# EAGLE schematic Oct20 (EAGLE 7.6.0)
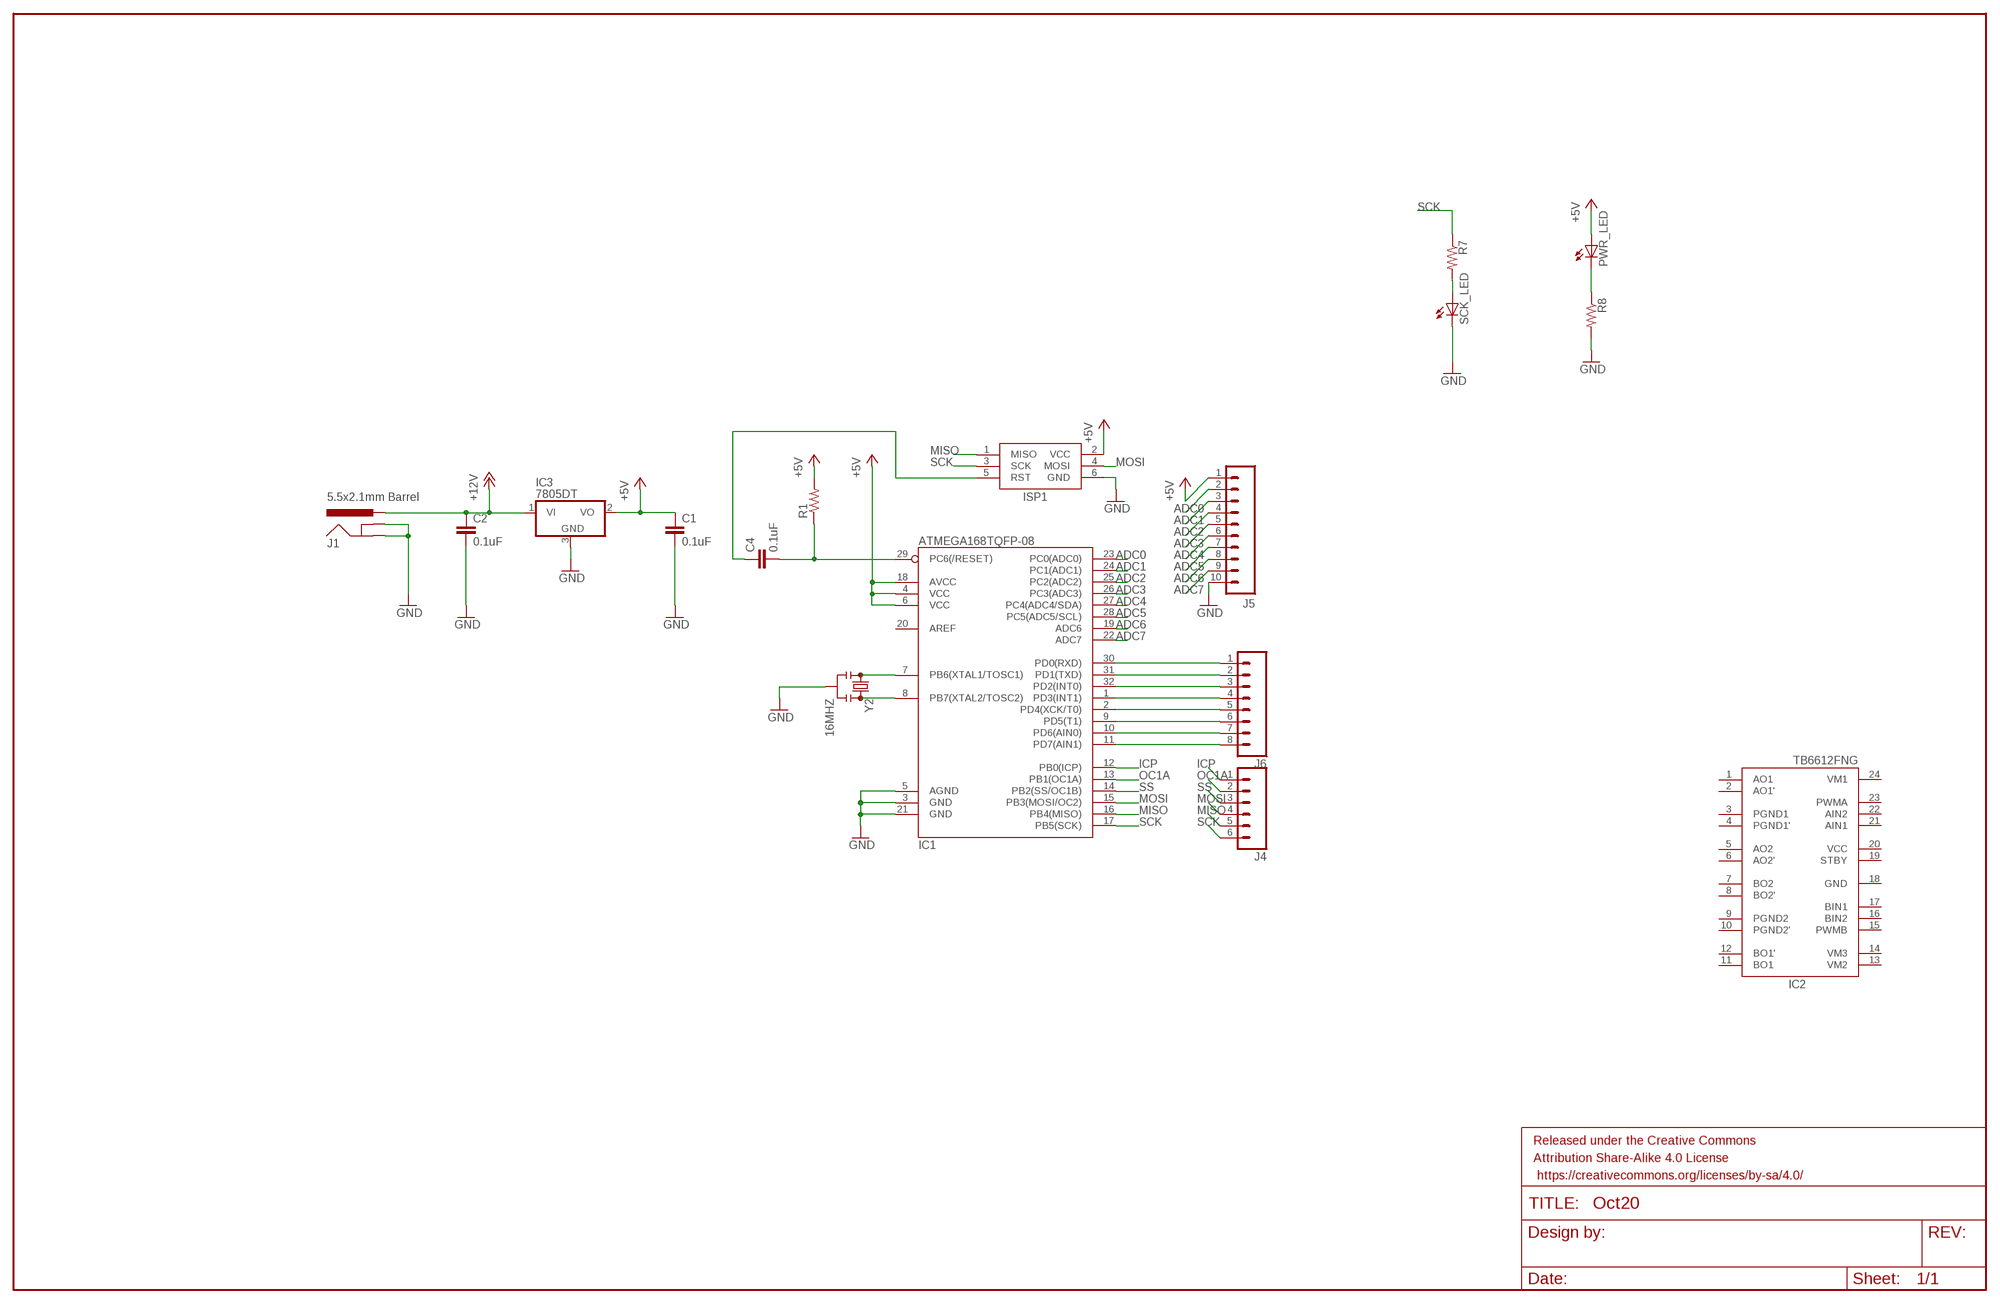
[diagram p0: schematic, sheet 1]

## Parts
C1  0.1uF  0.1UF-25V(+80/-20%)(0603)  [0603-CAP]
C2  0.1uF  0.1UF-25V(+80/-20%)(0603)  [0603-CAP]
C4  0.1uF  0.1UF-25V(+80/-20%)(0603)  [0603-CAP]
FRAME1  FRAME-LEDGER  [CREATIVE_COMMONS]
IC1  ATMEGA168TQFP-08  [TQFP32-08]
IC2  TB6612FNG  [SSOP24]
IC3  7805DT  [TO252]
ISP1  AVRISP-6  [AVRISP]
J1  5.5x2.1mm Barrel  POWER_JACKSMD  [POWER_JACK_SMD]
J4  M06SILK_FEMALE_PTH  [1X06]
J5  M10SILK_FEMALE_PTH  [1X10]
J6  M08  [1X08_ROUND]
PWR_LED  LED_E  [LED_1206]
R1  RESISTORPTH-1/4W  [AXIAL-0.4]
R7  RESISTORPTH-1/4W  [AXIAL-0.4]
R8  RESISTORPTH-1/4W  [AXIAL-0.4]
SCK_LED  LED_E  [LED_1206]
Y2  16MHZ  RESONATOR16MHZ  [RESONATOR-SMD]

## Nets
+5V: C1.1 IC1.4(VCC) IC1.6(VCC) IC1.18(AVCC) IC3.2(VO) ISP1.2(VCC) J5.1 PWR_LED.A R1.P$2
+12V: C2.1 IC3.1(VI) J1.VIN0(PWR)
ADC0: IC1.23(PC0(ADC0)) J5.2
ADC1: IC1.24(PC1(ADC1)) J5.3
ADC2: IC1.25(PC2(ADC2)) J5.4
ADC3: IC1.26(PC3(ADC3)) J5.5
ADC4: IC1.27(PC4(ADC4/SDA)) J5.6
ADC5: IC1.28(PC5(ADC5/SCL)) J5.7
ADC6: IC1.19(ADC6) J5.8
ADC7: IC1.22(ADC7) J5.9
GND: C1.2 C2.2 IC1.3(GND) IC1.5(AGND) IC1.21(GND) IC3.3(GND) ISP1.6(GND) J1.GND(GNDBREAK) J1.P$4(GND) J5.10 R8.P$2 SCK_LED.C Y2.2
ICP: IC1.12(PB0(ICP)) J4.1
MISO: IC1.16(PB4(MISO)) ISP1.1(MISO) J4.5
MOSI: IC1.15(PB3(MOSI/OC2)) ISP1.4(MOSI) J4.4
N$1: C4.2 IC1.29(PC6(/RESET)) R1.P$1
N$2: IC1.30(PD0(RXD)) J6.1
N$3: IC1.31(PD1(TXD)) J6.2
N$4: IC1.32(PD2(INT0)) J6.3
N$5: IC1.1(PD3(INT1)) J6.4
N$6: IC1.2(PD4(XCK/T0)) J6.5
N$7: IC1.9(PD5(T1)) J6.6
N$8: IC1.10(PD6(AIN0)) J6.7
N$9: IC1.11(PD7(AIN1)) J6.8
N$10: R7.P$2 SCK_LED.A
N$11: IC1.7(PB6(XTAL1/TOSC1)) Y2.1
N$12: PWR_LED.C R8.P$1
N$13: IC1.8(PB7(XTAL2/TOSC2)) Y2.3
N$14: C4.1 ISP1.5(RST)
OC1A: IC1.13(PB1(OC1A)) J4.2
SCK: IC1.17(PB5(SCK)) ISP1.3(SCK) J4.6 R7.P$1
SS: IC1.14(PB2(SS/OC1B)) J4.3
Unconnected: IC1.20(AREF) IC2.1(AO1) IC2.2(AO1') IC2.5(AO2) IC2.6(AO2') IC2.7(BO2) IC2.8(BO2') IC2.11(BO1) IC2.12(BO1') IC2.15(PWMB) IC2.16(BIN2) IC2.17(BIN1) IC2.19(STBY) IC2.21(AIN1) IC2.22(AIN2) IC2.23(PWMA)

## Power pins joined to a net without a drawn wire
GND: IC2.18(GND)
PGND1: IC2.3(PGND1)
PGND1': IC2.4(PGND1')
PGND2: IC2.9(PGND2)
PGND2': IC2.10(PGND2')
VCC: IC2.20(VCC)
VM1: IC2.24(VM1)
VM2: IC2.13(VM2)
VM3: IC2.14(VM3)

## Library data of the parts
C1 C2 C4 = SparkFun-Capacitors:0.1UF-25V(+80/-20%)(0603): CAP-00810 Ceramic Standard decoupling cap; PROD_ID: CAP-00810
FRAME1 = SparkFun-Aesthetics:FRAME-LEDGER: Schematic Frame Standard 11x14 US Ledger frame
IC1 = atmega328p:ATMEGA168
IC2 = adafruit:TB6612FNG: TB6612FNG MOS dual H-bridge motor driver, 1.2A current 3.2A peak 3 or 5v logic and 3-15v motor
IC3 = adafruit:78*: Positive VOLTAGE REGULATOR Added bigger pads to the TO-92 package
ISP1 = adafruit:AVRISP: AVR ISP HEADER Standard 6 pin header for AVR programming
J1 = SparkFun-Connectors:POWER_JACK: Power Jack This is the standard 5.5mm barrel jack for power. The PTH is the most common, proven, reliable, footprint. The Slot footprint only works if the mill layer is transmitted to the PCB fab house so be warned. Mating wall wart : TOL-00298 (and others); PROD_ID: CONN-08106; SF_ID: PRT-12748
J4 = SparkFun-Connectors:M06: Header 6 Standard 6-pin 0.1" header. Use with straight break away headers (SKU : PRT-00116), right angle break away headers (PRT-00553), swiss pins (PRT-00743), machine pins (PRT-00117), and female headers (PRT-00115). Molex polarized connector foot print use with SKU : PRT-08094 with associated crimp pins and housings. NOTES ON THE VARIANTS LOCK and LOCK_LONGPADS... This footprint was designed to help hold the alignment of a through-hole component (i.e. 6-pin header) while soldering it into place. You may notice that each hole has been shifted either up or down by 0.005 of an inch from it's more standard position (which is a perfectly straight line). This slight alteration caused the pins (the squares in the middle) to touch the edges of the holes. Because they are alternating, it causes a "brace" to hold the component in place. 0.005 has proven to be the perfect amount of "off-center" position when using our standard breakaway headers. Although looks a little odd when you look at the bare footprint, once you have a header in there, the alteration is very hard to notice. Also,if you push a header all the way into place, it is covered up entirely on the bottom side. This idea of altering the position of holes to aid alignment will be further integrated into the Sparkfun Library for other footprints. It can help hold any component with 3 or more connection pins.; PROD_ID: CONN-08437
J5 = SparkFun-Connectors:M10: Header 10 Standard 10-pin 0.1" header. Use with straight break away headers (SKU : PRT-00116), right angle break away headers (PRT-00553), swiss pins (PRT-00743), machine pins (PRT-00117), and female headers (PRT-00115).; PROD_ID: CONN-11563
J6 = SparkFun-Connectors:M08: Header 8 Standard 8-pin 0.1" header. Use with straight break away headers (SKU : PRT-00116), right angle break away headers (PRT-00553), swiss pins (PRT-00743), machine pins (PRT-00117), and female headers (PRT-00115).; PROD_ID: CONN-08437
PWR_LED SCK_LED = eagle-ltspice:LED_E: LED Source: http://www.osram.convergy.de Source: www.luxeon.com Source: www.kingbright.com; SPICEMODEL: NONE; SPICEPREFIX: D; SPICETYPE: diode
R1 R7 R8 = SparkFun-Resistors:RESISTOR: Resistor Basic schematic elements and footprints for 0603, 1206, and PTH resistors.
Y2 = SparkFun-FreqCtrl:RESONATOR: Resonator Small SMD resonator. Used, eg, on the Arduino Pro/ Pro Mini boards. 8MHz- XTAL-08895 16MHz- XTAL-08900; PROD_ID: XTAL-08900